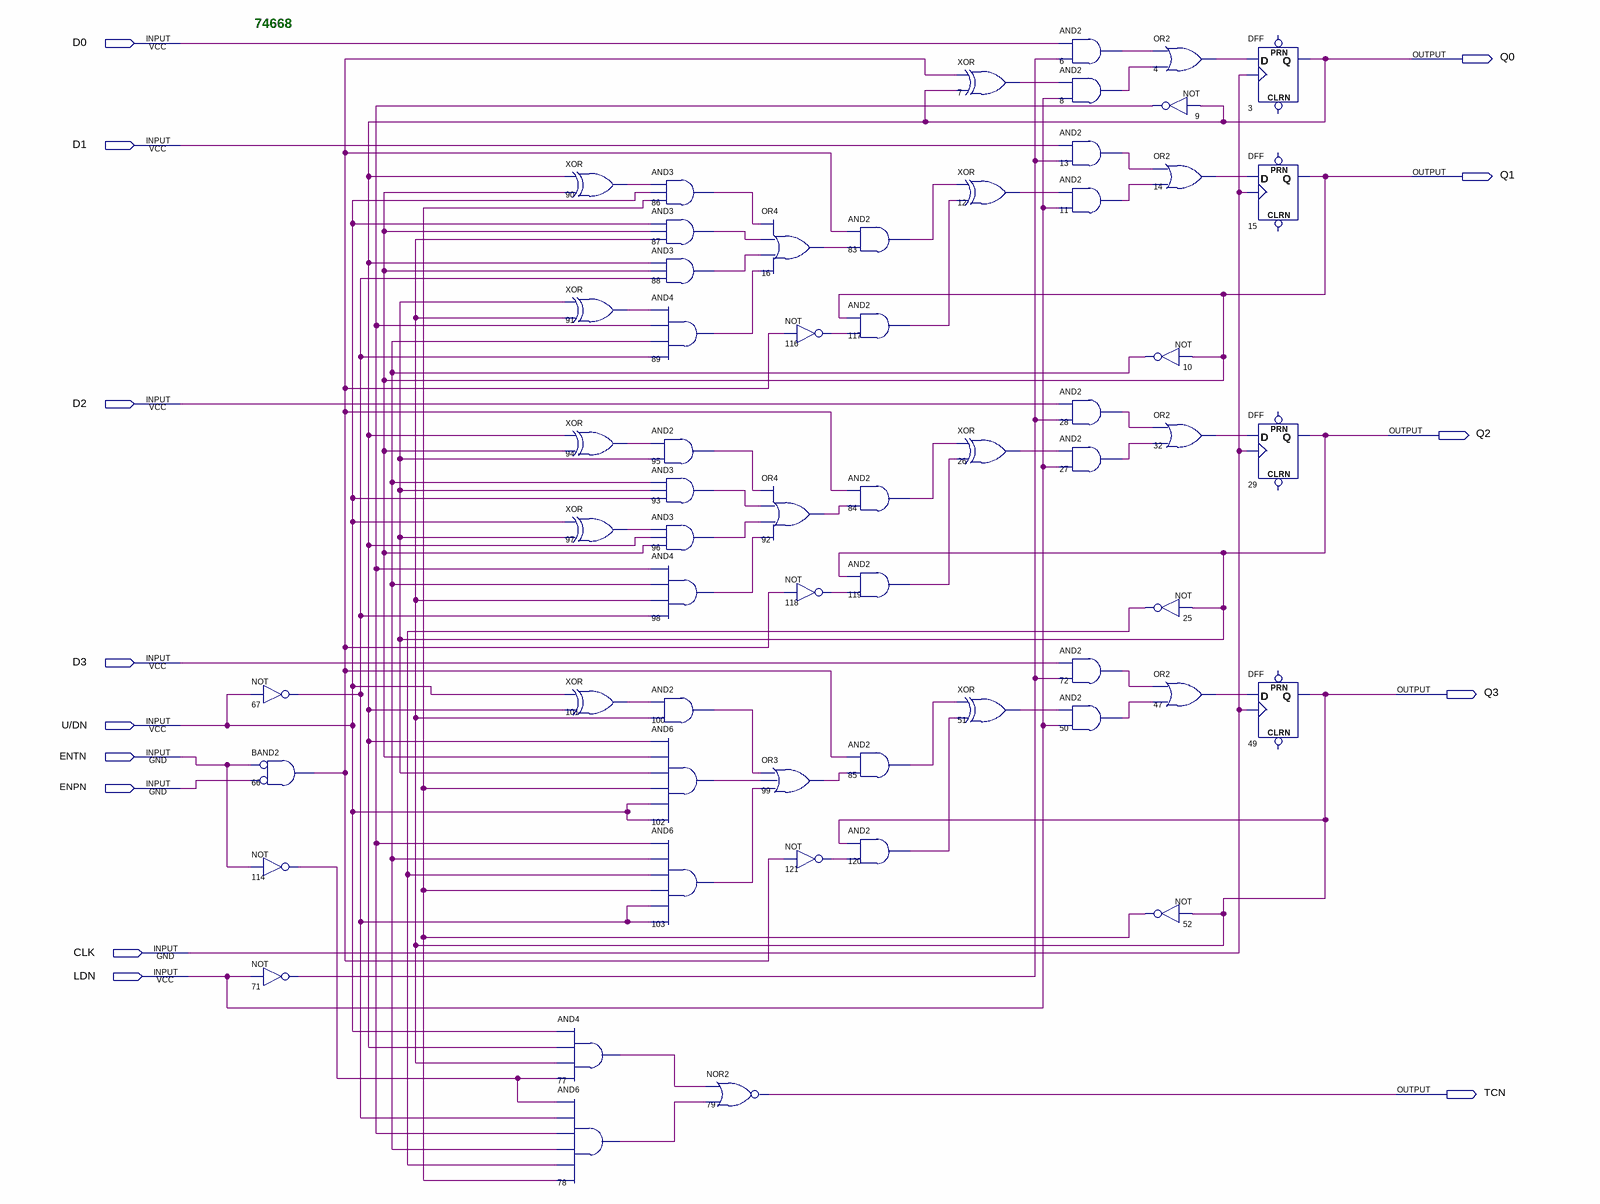
[diagram p0: schematic sheet]
// Quartus schematic 74668.bdf as structural Verilog: 59 symbols, 14 pins
module \74668  (
  input  D0,
  input  D1,
  input  D2,
  input  D3,
  input  \U/DN ,
  input  ENTN,
  input  ENPN,
  input  CLK,
  input  LDN,
  output Q0,
  output Q1,
  output Q2,
  output Q3,
  output TCN
);

  wire n4_out, n6_out, n7_out, n8_out, n9_out, n10_out, n11_out, n12_out, n13_out, n14_out, n16_out, n25_out,
       n26_out, n27_out, n28_out, n32_out, n47_out, n50_out, n51_out, n52_out, n66_out, n67_out, n71_out,
       n72_out, n77_out, n78_out, n83_out, n84_out, n85_out, n86_out, n87_out, n88_out, n89_out, n90_out,
       n91_out, n92_out, n93_out, n94_out, n95_out, n96_out, n97_out, n98_out, n99_out, n100_out, n101_out,
       n102_out, n103_out, n114_out, n116_out, n117_out, n118_out, n119_out, n120_out, n121_out;

  not u_67 (n67_out, \U/DN );
  and u_66 (n66_out, ~ENTN, ~ENPN);  // BAND2
  not u_114 (n114_out, ENTN);
  not u_71 (n71_out, LDN);
  xor u_90 (n90_out, Q0, Q1);
  xor u_91 (n91_out, Q2, Q3);
  xor u_94 (n94_out, Q0, Q1);
  xor u_97 (n97_out, \U/DN , Q2);
  xor u_101 (n101_out, \U/DN , Q0);
  and u_77 (n77_out, \U/DN , Q0, Q3, n114_out);
  and u_78 (n78_out, n114_out, n67_out, n9_out, n10_out, n25_out, n52_out);
  and u_86 (n86_out, n90_out, \U/DN , n52_out);
  and u_87 (n87_out, \U/DN , Q1, Q3);
  and u_88 (n88_out, Q0, Q1, n67_out);
  and u_89 (n89_out, n91_out, n9_out, n10_out, n67_out);
  and u_95 (n95_out, n94_out, Q2);
  and u_93 (n93_out, n10_out, Q2, \U/DN );
  and u_96 (n96_out, n97_out, Q0, Q1);
  and u_98 (n98_out, n9_out, n10_out, Q3, n67_out);
  and u_100 (n100_out, n101_out, Q3);
  and u_102 (n102_out, Q0, Q1, Q2, n52_out, \U/DN , \U/DN );
  and u_103 (n103_out, n9_out, n10_out, n25_out, n52_out, n67_out, n67_out);
  nor u_79 (TCN, n77_out, n78_out);
  or u_16 (n16_out, n86_out, n87_out, n88_out, n89_out);
  not u_116 (n116_out, n66_out);
  or u_92 (n92_out, n95_out, n93_out, n96_out, n98_out);
  not u_118 (n118_out, n66_out);
  or u_99 (n99_out, n100_out, n102_out, n103_out);
  not u_121 (n121_out, n66_out);
  and u_83 (n83_out, n66_out, n16_out);
  and u_117 (n117_out, Q1, n116_out);
  and u_84 (n84_out, n66_out, n92_out);
  and u_119 (n119_out, Q2, n118_out);
  and u_85 (n85_out, n66_out, n99_out);
  and u_120 (n120_out, Q3, n121_out);
  xor u_7 (n7_out, n66_out, Q0);
  xor u_12 (n12_out, n83_out, n117_out);
  xor u_26 (n26_out, n84_out, n119_out);
  xor u_51 (n51_out, n85_out, n120_out);
  and u_6 (n6_out, D0, n71_out);
  and u_8 (n8_out, n7_out, LDN);
  and u_13 (n13_out, D1, n71_out);
  and u_11 (n11_out, n12_out, LDN);
  and u_28 (n28_out, D2, n71_out);
  and u_27 (n27_out, n26_out, LDN);
  and u_72 (n72_out, D3, n71_out);
  and u_50 (n50_out, n51_out, LDN);
  or u_4 (n4_out, n6_out, n8_out);
  not u_9 (n9_out, Q0);
  or u_14 (n14_out, n13_out, n11_out);
  not u_10 (n10_out, Q1);
  or u_32 (n32_out, n28_out, n27_out);
  not u_25 (n25_out, Q2);
  or u_47 (n47_out, n72_out, n50_out);
  not u_52 (n52_out, Q3);
  DFF u_3 (.CLK(CLK), .D(n4_out), .Q(Q0));  // open: CLRN, PRN
  DFF u_15 (.CLK(CLK), .D(n14_out), .Q(Q1));  // open: CLRN, PRN
  DFF u_29 (.CLK(CLK), .D(n32_out), .Q(Q2));  // open: CLRN, PRN
  DFF u_49 (.CLK(CLK), .D(n47_out), .Q(Q3));  // open: CLRN, PRN

  // Notes on the sheet:
  //   74668
endmodule
